# EAGLE design Tiny-Cairoduino (EAGLE 9.6.2)
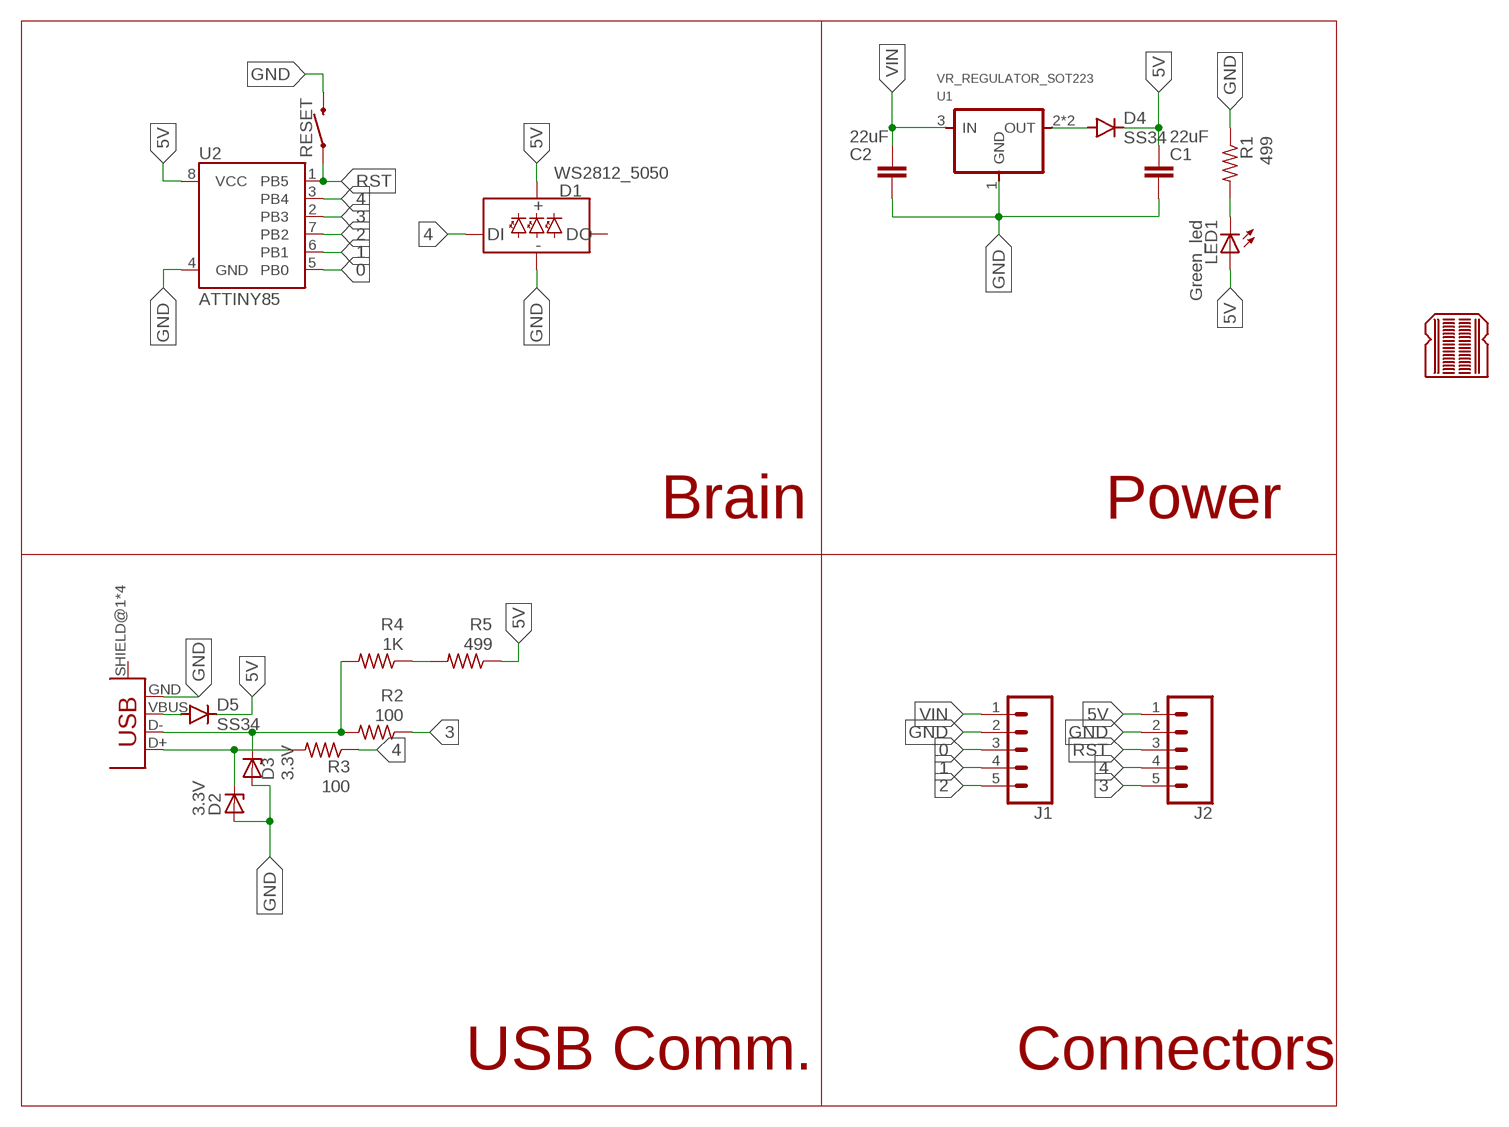
[diagram p0: schematic, sheet 1]

## Parts
C1  22uF  22UF-0805-16V-20%  [0805]
C2  22uF  22UF-0805-16V-20%  [0805]
D1  WS2812_5050  [WS2812-5X5-4PIN]
D2  3.3V  DIODE_ZENERSOD123  [SOD123]
D3  3.3V  DIODE_ZENERSOD123  [SOD123]
D4  SS34  DIODE-DO-214AC  [DO-214AC]
D5  SS34  DIODE-DO-214AC  [DO-214AC]
J1  CONN_05  [1X05]
J2  CONN_05  [1X05]
LED1  Green_led  LEDCHIP-LED0805  [CHIP-LED0805]
LOGO1  BREADBOARD_PATTERN  [BREADBOARD_SPACING]
R1  499  R1206FAB  [R1206FAB]
R2  100  R1206FAB  [R1206FAB]
R3  100  R1206FAB  [R1206FAB]
R4  1K  R1206FAB  [R1206FAB]
R5  499  R1206FAB  [R1206FAB]
RESET  MOMENTARY-SWITCH-SPST-SMD-6.0X3.5MM  [TACTILE_SWITCH_SMD_6.0X3.5MM]
U1  VR_REGULATOR_SOT223  [SOT223]
U2  ATTINY85  [ATTINY85]
U$2  CONN_USB_MINIB  [USB_MINIB]

## Nets
0: J1.3 U2.5(PB0)
1: J1.4 U2.6(PB1)
2: J1.5 U2.7(PB2)
3: J2.5 R2.1 U2.2(PB3)
4: D1.DI J2.4 R3.1 U2.3(PB4)
5V: C1.1 D1.VCC D4.C D5.C J2.1 LED1.A R5.1 U2.8(VCC)
GND: C1.2 C2.2 D1.GND D2.ANODE D3.ANODE J1.2 J2.2 R1.1 RESET.2 U1.1(GND) U2.4(GND) U$2.GND
N$1: LED1.C R1.2
N$2: D5.A U$2.VBUS
N$3: R4.1 R5.2
N$4: D3.CATHODE R2.2 R4.2 U$2.D-
N$5: D2.CATHODE R3.2 U$2.D+
N$6: D4.A U1.2(OUT) U1.4(OUT)
RST: J2.3 RESET.1 U2.1(PB5)
VIN: C2.1 J1.1 U1.3(IN)
Unconnected: D1.DO U$2.SHIELD@1(SHIELD) U$2.SHIELD@2(SHIELD) U$2.SHIELD@3(SHIELD) U$2.SHIELD@4(SHIELD)

## Notes on the sheet
- Brain | Power
- USB Comm. | Connectors

## Library data of the parts
C1 C2 = SparkFun-Capacitors:22UF: 22µF ceramic capacitors A capacitor is a passive two-terminal electrical component used to store electrical energy temporarily in an electric field.; PROD_ID: CAP-14260
D1 = SparkFun-LED:WS2812: Addressable RGB LED - 1 Wire Common names: WS2812, SK6812, Neopixel, APA-106, etc. SMD LED with built-in controller IC. Color: Red/Green/Blue SparkFun Products: LED-SMD RGB (WS2812) <https://www.sparkfun.com/products/11821> LED - RGB Addressable, PTH, 5mm Diffused (5 Pack) <https://www.sparkfun.com/products/12986> LED - RGB Addressable, PTH, 5mm Clear (5 Pack) <https://www.sparkfun.com/products/12999> Blynk Board - ESP8266 <https://www.sparkfun.com/products/13794> Datasheet referenced for footprint: WS2812B-PTH <https://cdn.sparkfun.com/datasheets/Components/LED/COM-12877.pdf>; PROD_ID: DIO-12503
D2 D3 = fab:DIODE_ZENER: zener diode
D4 D5 = diode:DIODE-: DIODE
J1 J2 = SparkFun-Connectors:CONN_05: Multi connection point. Often used as Generic Header-pin footprint for 0.1 inch spaced/style header connections On any of the 0.1 inch spaced packages, you can populate with these: Break Away Headers - Straight <https://www.sparkfun.com/products/116> (PRT-00116) Break Away Male Headers - Right Angle <https://www.sparkfun.com/products/553> (PRT-00553) Female Headers <https://www.sparkfun.com/products/115> (PRT-00115) Break Away Headers - Machine Pin <https://www.sparkfun.com/products/117> (PRT-00117) Break Away Female Headers - Swiss Machine Pin <https://www.sparkfun.com/products/743> (PRT-00743) For SCREWTERMINALS and SPRING TERMINALS visit here: Screw Terimnals on SparkFun.com <https://www.sparkfun.com/search/results?term=Screw+Terminals> (5mm/3.5mm/2.54mm spacing) This device is also useful as a general connection point to wire up your design to another part of your project. Our various solder wires solder well into these plated through hole pads. Hook-Up Wire - Assortment (Stranded, 22 AWG) <https://www.sparkfun.com/products/11375> (PRT-11375) Hook-Up Wire - Assortment (Solid Core, 22 AWG) <https://www.sparkfun.com/products/11367> (PRT-11367) View the entire wire category on our website here <https://www.sparkfun.com/categories/141> Special notes: Molex polarized connector foot print use with SKU : PRT-08231 with associated crimp pins and housings. 1MM SMD Version SKU: PRT-10208
LED1 = adafruit:LED: LED OSRAM: - CHIPLED LG R971, LG N971, LY N971, LG Q971, LY Q971, LO R971, LY R971 LH N974, LH R974 LS Q976, LO Q976, LY Q976 LO Q996 - Hyper CHIPLED LW Q18S LB Q993, LB Q99A, LB R99A - SideLED LS A670, LO A670, LY A670, LG A670, LP A670 LB A673, LV A673, LT A673, LW A673 LH A674 LY A675 LS A676, LA A676, LO A676, LY A676, LW A676 LS A679, LY A679, LG A679 - Hyper Micro SIDELED® LS Y876, LA Y876, LO Y876, LY Y876 LT Y87S - SmartLED LW L88C, LW L88S LB L89C, LB L89S, LG L890 LS L89K, LO L89K, LY L89K LS L896, LA L896, LO L896, LY L896 - TOPLED LS T670, LO T670, LY T670, LG T670, LP T670 LSG T670, LSP T670, LSY T670, LOP T670, LYG T670 LG T671, LOG T671, LSG T671 LB T673, LV T673, LT T673, LW T673 LH T674 LS T676, LA T676, LO T676, LY T676, LB T676, LH T676, LSB T676, LW T676 LB T67C, LV T67C, LT T67C, LS T67K, LO T67K, LY T67K, LW E67C LS E67B, LA E67B, LO E67B, LY E67B, LB E67C, LV E67C, LT E67C LW T67C LS T679, LY T679, LG T679 LS T770, LO T770, LY T770, LG T770, LP T770 LB T773, LV T773, LT T773, LW T773 LH T774 LS E675, LA E675, LY E675, LS T675 LS T776, LA T776, LO T776, LY T776, LB T776 LHGB T686 LT T68C, LB T68C - Hyper Mini TOPLED® LB M676 - Mini TOPLED Santana® LG M470 LS M47K, LO M47K, LY M47K Source: http://www.osram.convergy.de/
LOGO1 = SparkFun-Aesthetics:BREADBOARD_PATTERN: Breadboard-Spacing Reference tDoc reference markings that correspond to solderless breadboard row spacing. Includes power rails and void space between rows.
R1-R5 = fab:R: Resistor (US Symbol) Variants with postfix FAB are widened to allow the routing of internal traces
RESET = SparkFun-Switches:MOMENTARY-SWITCH-SPST: Momentary Switch (Pushbutton) - SPST Normally-open (NO) SPST momentary switches (buttons, pushbuttons). Variants PTH-12MM - 12mm square, through-hole Momentary Pushbutton Switch - 12mm Square <https://www.sparkfun.com/products/9190> (COM-09190) PTH-6.0MM, PTH-6.0MM-KIT - 6.0mm square, through-hole Mini Pushbutton Switch <https://www.sparkfun.com/products/97> (COM-00097) KIT package intended for soldering kit's - only one side of pads' copper is exposed. PTH-RIGHT-ANGLE-KIT - Right-angle, through-hole Right Angle Tactile Button <https://www.sparkfun.com/products/10791> - Used on SparkFun BigTime Watch Kit <https://www.sparkfun.com/products/11734> SMD-12MM - 12mm square, surface-mount Tactile Button - SMD (12mm) <https://www.sparkfun.com/products/12993> (COM-12993) Used on SparkFun PicoBoard <https://www.sparkfun.com/products/11888> SMD-4.5MM - 4.5mm Square Trackball Switch Used on SparkFun Blackberry Trackballer Breakout <https://www.sparkfun.com/products/13169> SMD-4.6MMX2.8MM - 4.60mm x 2.80mm, surface mount Used on SparkFun Pro Micro - RP2040 <https://www.sparkfun.com/products/17717> SMD-5.2MM, SMD-5.2-REDUNDANT - 5.2mm square, surface-mount Mini Pushbutton Switch - SMD <https://www.sparkfun.com/products/8720> (COM-08720) Used on Arduino Pro Mini <https://www.sparkfun.com/products/11114> REDUNDANT package connects both switch circuits together SMD-6.0X3.5MM - 6.0 x 3.5mm, surface mount Momentary Reset Switch SMD <https://www.sparkfun.com/products/8229> (COM-08229) SMD-6.2MM-TALL - 6.2mm square, surface mount Tactile Button - SMD (6mm) <https://www.sparkfun.com/products/12992> Used on SparkFun Digital Sandbox <https://www.sparkfun.com/products/12651> SMD-RIGHT-ANGLE - Right-angle, surface mount Used on SparkFun Block for Intel® Edison - Arduino <https://www.sparkfun.com/products/13036>; PROD_ID: SWCH-14278; SF_SKU: COM-08229
U1 = fab:VR_REGULATOR_SOT223
U2 = SparkFun-IC-Microcontroller:ATTINY85; PROD_ID: IC-09092
U$2 = fab:CONN_USB_MINIB

## Board
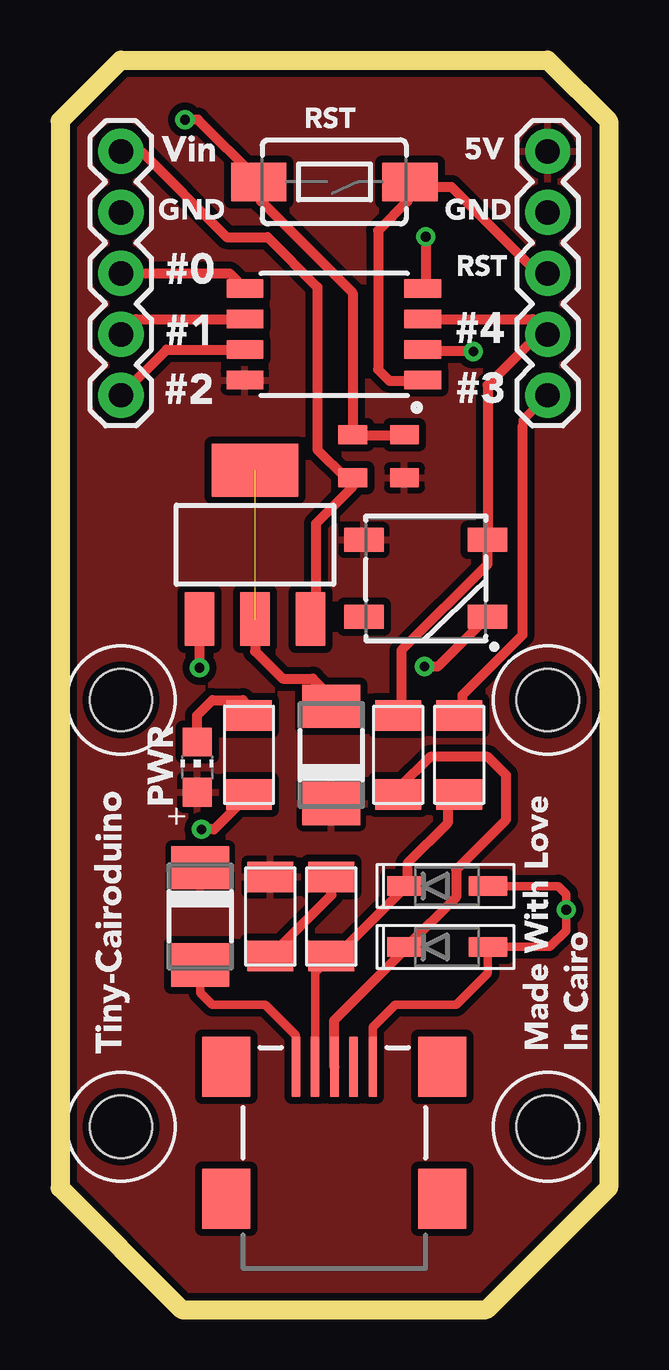
[diagram p1: board, top side]
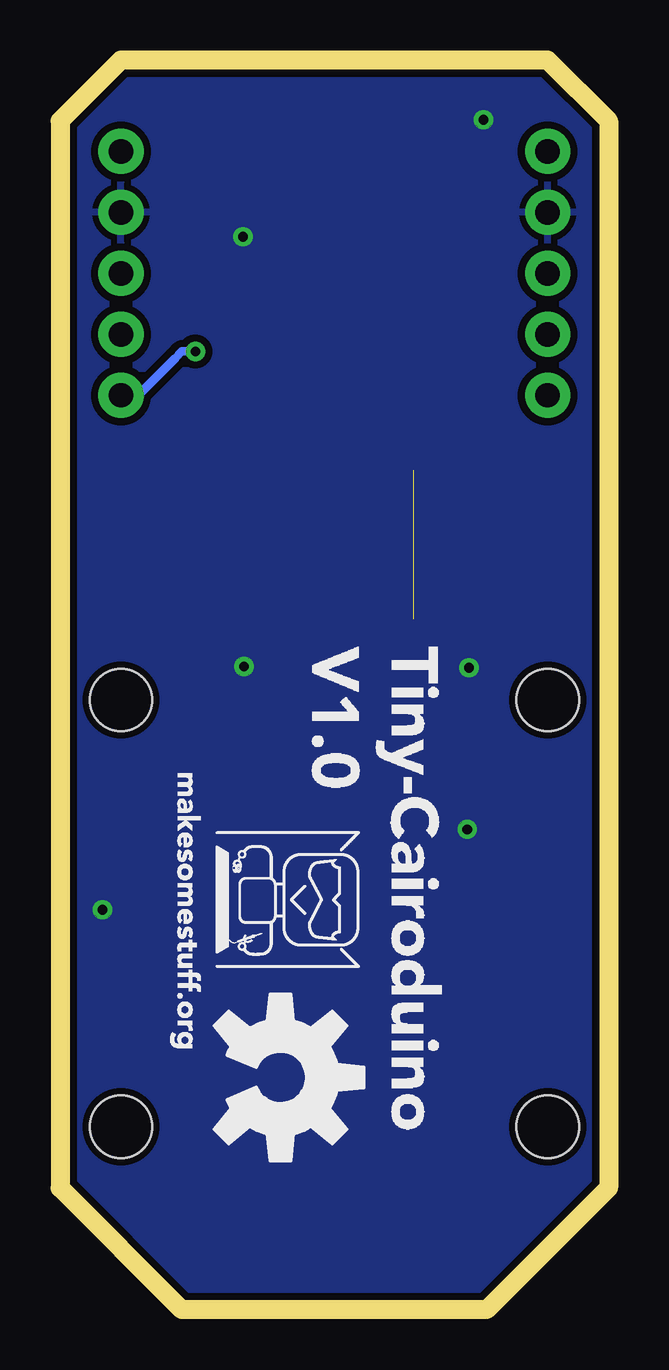
[diagram p2: board, bottom side, seen from below]

Size 22.86 x 52.07 mm. Coordinates in mm from the lower left corner, seen from the top.
Outline: 0,49.53 2.54,52.07 20.32,52.07 22.86,49.53 22.86,5.08 17.78,0 5.08,0 0,5.08 0,49.53
Copper layers (1*16): Top 0.035mm / dielectric 1.5mm / Bottom 0.035mm
Design rules "default *": minimum track width 0.3mm, minimum drill 0.3mm, track to track 10mil, track to pad 10mil, pad to pad 10mil, via to via 10mil, smd to smd 10mil, copper to edge 10mil, drill to drill 10mil, minimum pad ring 10mil, minimum via ring 8mil, stop-mask expansion 4mil, vias tented up to drill 0mil, thermal gap 10mil
Holes 2.6 mm at 20.32,7.62 2.54,7.62 20.32,25.4 2.54,25.4

### Footprints (pad centres in the part's own frame; a part is rotated, then mirrored left to right if it is on the bottom)
0805 = smd 0.8 x 1.2: 1 -0.9,0; 2 0.9,0
WS2812-5X5-4PIN = smd 1.651 x 1: DI 2.577,1.6; DO -2.577,-1.6; GND 2.577,-1.6; VCC -2.577,1.6
SOD123 = smd 1.6 x 0.8: ANODE 1.7,0; CATHODE -1.7,0
DO-214AC = smd 1.8 x 2.4: A 2.025,0; C -2.025,0
1X05 = drill 1.016 pad 1.88: 1 0,0; 2 2.54,0; 3 5.08,0; 4 7.62,0; 5 10.16,0
CHIP-LED0805 = smd 1.2 x 1.2: A 0,-1.05; C 0,1.05
R1206FAB = smd 1.27 x 1.905: 1 -1.651,0; 2 1.651,0
TACTILE_SWITCH_SMD_6.0X3.5MM = smd 2.3 x 1.6: 1 -3.15,0; 2 3.15,0
SOT223 = smd 1.219 x 2.235: 1 -2.311,-3.099; 2 0,-3.099; 3 2.311,-3.099 | smd 3.6 x 2.2: 4 0,3.099
ATTINY85 = smd 1.524 x 0.762: 1 -3.683,1.905; 2 -3.683,0.635; 3 -3.683,-0.635; 4 -3.683,-1.905; 5 3.727,-1.905; 6 3.727,-0.635; 7 3.727,0.635; 8 3.727,1.905
USB_MINIB = smd 2.5 x 0.35: D+ 3.77,0; D- 3.77,0.8; GND 3.77,-1.6; ID 3.77,-0.8; VBUS 3.77,1.6 | smd 2.5 x 2: SHIELD@1 -1.73,-4.5; SHIELD@2 -1.73,4.5; SHIELD@3 3.77,4.5; SHIELD@4 3.77,-4.5

### Placement (x,y rotation side)
C1  14.35,35.56 90 top
C2  12.19,35.56 90 top
D1  15.24,30.48 0 top
D2  16.13,15.11 0 top
D3  16.13,17.65 0 top
D4  11.3,23.11 90 top
D5  5.84,16.38 270 top
J1  2.54,48.26 270 top
J2  20.32,48.26 270 top
LED1  5.71,22.61 0 top
LOGO1  19,-10.26 0 top  (outside the outline)
R1  7.87,23.11 90 top
R2  16.64,23.11 270 top
R3  14.1,23.11 270 top
R4  11.3,16.38 270 top
R5  8.76,16.38 270 top
RESET  11.43,46.99 180 top
U1  8.13,31.88 0 top
U2  11.43,40.64 180 top
U$1  [OSHW-LOGO-L]  13.68,9.68 270 bottom
U$2  11.43,6.35 90 top

### Tracks (layer width: path | path; a pad name or v marks a point on that pad's centre or on a via)
0
  Top 0.406: J1.3 7.07,43.18 U2.5
1
  Top 0.406: J1.4 3.17,41.27 U2.6
2
  Top 0.406: J1.5 4.45,40.01 U2.7
3  (via drill 0.4)
  Top 0.35: 19.28,36.8 19.28,37.06 J2.5
  Top 0.406: v17.22,39.93 15.24,39.93 U2.2 | R2.1 16.76,24.84 16.76,25.6 19.28,28.12 19.28,36.8
  Bottom 0.35: J2.5 19.61,38.1 18.06,39.65 17.78,39.93 v17.22,39.93
4
  Top 0.406: R3.1 14.22,24.89 14.22,27.47 17.82,31.06 D1.DI 17.82,38.52 19.94,40.64 J2.4 19.68,41.27 U2.3
5V
  pour Top (isolate 0.3): 5.08,0 0,5.08 0,49.53 2.54,52.07 20.32,52.07 22.86,49.53 22.86,5.08 17.78,0
GND  (via drill 0.4)
  Top 0.35: U$2.GND 13.03,11.76 13.97,12.7 16.51,12.7 17.83,14.02 D2.ANODE 20.41,15.11 21.09,15.8 v21.09,16.66 21.09,17.31 20.75,17.65 D3.ANODE
  Top 0.406: 17.83,17.53 D3.ANODE | C1.2 14.33,36.42 12.19,36.42 C2.2 12.19,42.37 8.38,46.18 8.38,46.94 RESET.2 8.23,47.09 5.74,49.58 v5.21,49.58 | v15.24,44.7 15.24,42.67 U2.4 | D1.GND 15.73,26.8 v15.19,26.8 | R1.1 6.43,20.02 v5.89,20.02 | v5.82,26.75 U1.1
  pour Bottom (isolate 0.3): 5.08,0 0,5.08 0,49.53 2.54,52.07 20.32,52.07 22.86,49.53 22.86,5.08 17.78,0
N$1
  Top 0.406: LED1.C 5.71,24.77 6.35,25.4 7.62,25.4 7.87,25.15 R1.2
N$2
  Top 0.35: D5.A 5.84,13.21 6.35,12.7 8.56,12.7 9.83,11.43 U$2.VBUS
N$3
  Top 0.406: R5.2 11.3,17.27 R4.1
N$4
  Top 0.35: U$2.D- 10.63,14.06 R4.2
  Top 0.406: R2.2 16.61,21.34 16.15,20.88 16.15,20.27 14.48,18.59 14.48,17.68 D3.CATHODE 11.51,14.73 R4.2
N$5
  Top 0.406: R3.2 14.1,21.72 15.42,23.04 17.83,23.04 18.59,22.28 18.59,20.42 16.51,18.34 16.51,17.19 D2.CATHODE 14.43,15.06 11.43,12.06 U$2.D+
N$6  (1 unrouted)
  Top 0.406: U1.2 8.13,27.43 9.27,26.29 10.54,26.29 11.3,25.53 D4.A
RST
  Top 0.406: 14.48,46.79 14.48,46.94 RESET.1 14.48,46.79 | 14.48,46.79 14.48,46.18 13.26,44.96 13.26,39.17 13.72,38.71 15.09,38.71 U2.1 | 14.48,46.79 16.31,46.79 19.81,43.28 20.27,43.28 J2.3
VIN
  Top 0.406: U1.3 10.52,28.8 10.67,28.96 10.67,32.77 12.19,34.29 C2.1 11.91,34.66 10.73,35.84 10.73,42.61 8.65,44.69 6.95,44.69 3.38,48.26 J1.1